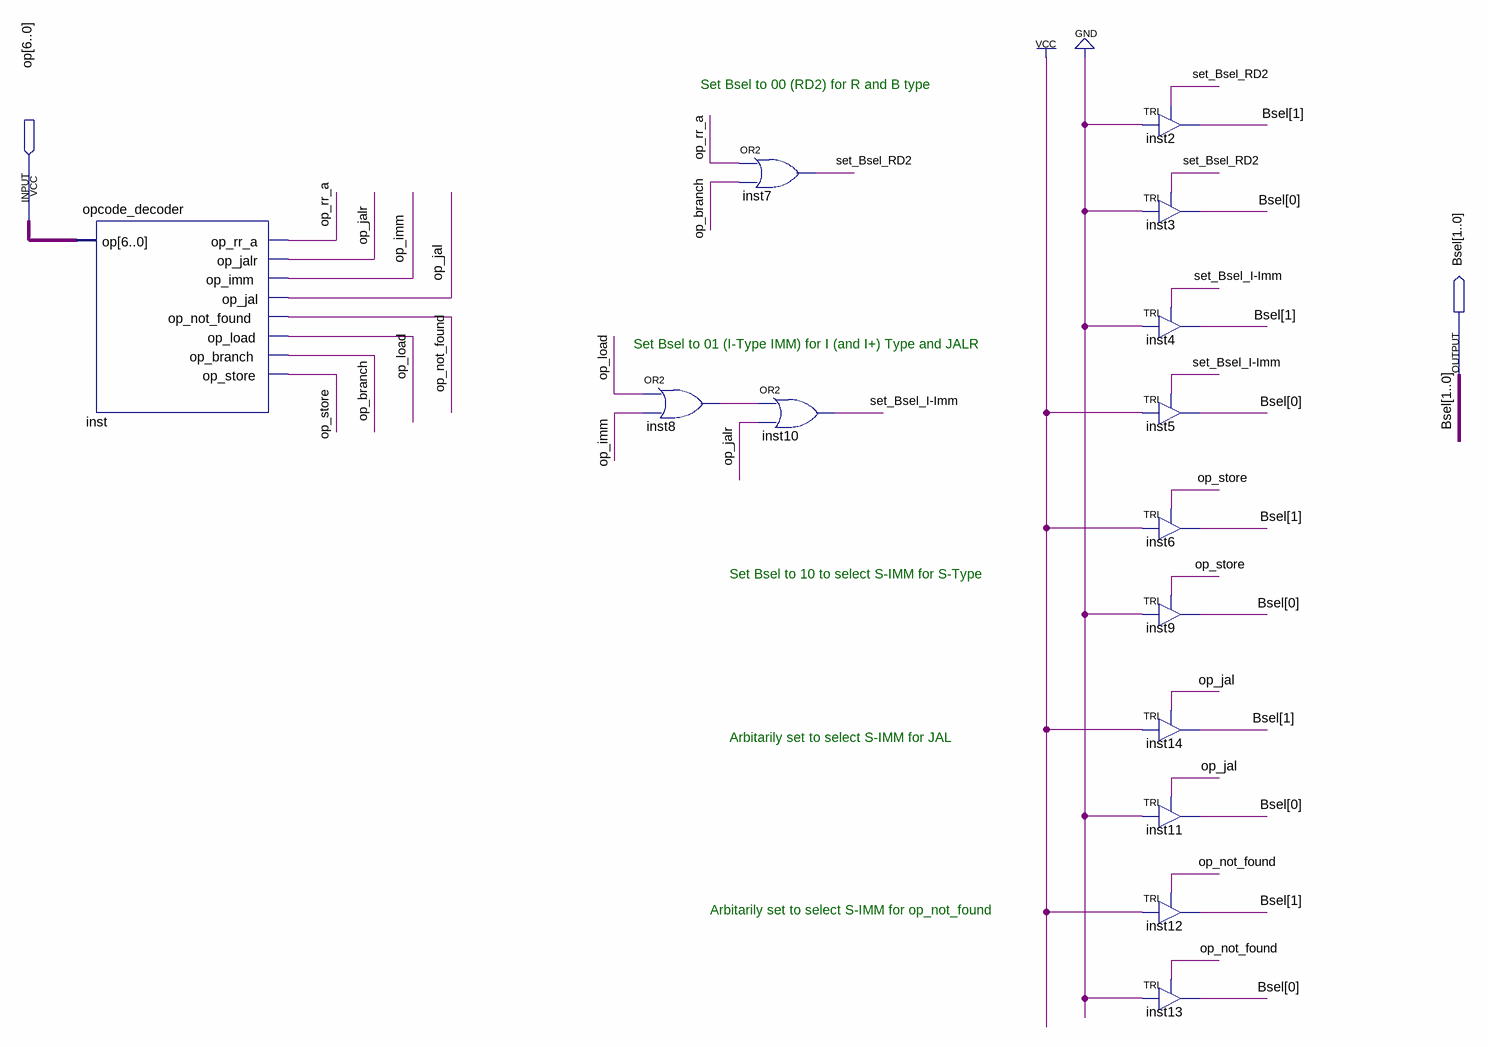
[diagram p0: schematic sheet]
// Quartus schematic Bsel_setter.bdf as structural Verilog: 14 symbols, 2 pins
module Bsel_setter (
  input  [6:0] op,
  output [1:0] Bsel
);

  wire inst8_out, op_branch, op_imm, op_jal, op_jalr, op_load, op_not_found, op_rr_a, op_store,
       \set_Bsel_I-Imm , set_Bsel_RD2;

  opcode_decoder inst (
    .op(op), .op_rr_a(op_rr_a), .op_jalr(op_jalr), .op_imm(op_imm), .op_jal(op_jal),
    .op_not_found(op_not_found), .op_load(op_load), .op_branch(op_branch), .op_store(op_store));
  or inst8 (inst8_out, op_load, op_imm);
  or inst7 (set_Bsel_RD2, op_rr_a, op_branch);
  or inst10 (\set_Bsel_I-Imm , inst8_out, op_jalr);
  TRI inst2 (.IN(1'b0), .OE(set_Bsel_RD2), .OUT(Bsel[1]));
  TRI inst3 (.IN(1'b0), .OE(set_Bsel_RD2), .OUT(Bsel[0]));
  TRI inst4 (.IN(1'b0), .OE(\set_Bsel_I-Imm ), .OUT(Bsel[1]));
  TRI inst5 (.IN(1'b1), .OE(\set_Bsel_I-Imm ), .OUT(Bsel[0]));
  TRI inst6 (.IN(1'b1), .OE(op_store), .OUT(Bsel[1]));
  TRI inst9 (.IN(1'b0), .OE(op_store), .OUT(Bsel[0]));
  TRI inst14 (.IN(1'b1), .OE(op_jal), .OUT(Bsel[1]));
  TRI inst11 (.IN(1'b0), .OE(op_jal), .OUT(Bsel[0]));
  TRI inst12 (.IN(1'b1), .OE(op_not_found), .OUT(Bsel[1]));
  TRI inst13 (.IN(1'b0), .OE(op_not_found), .OUT(Bsel[0]));

  // Notes on the sheet:
  //   Set Bsel to 00 (RD2) for R and B type
  //   Set Bsel to 01 (I-Type IMM) for I (and I+) Type and JALR
  //   Set Bsel to 10 to select S-IMM for S-Type
  //   Arbitarily set to select S-IMM for JAL
  //   Arbitarily set to select S-IMM for op_not_found
endmodule
